# EAGLE schematic flux2_a1 (EAGLE 7.2.0)
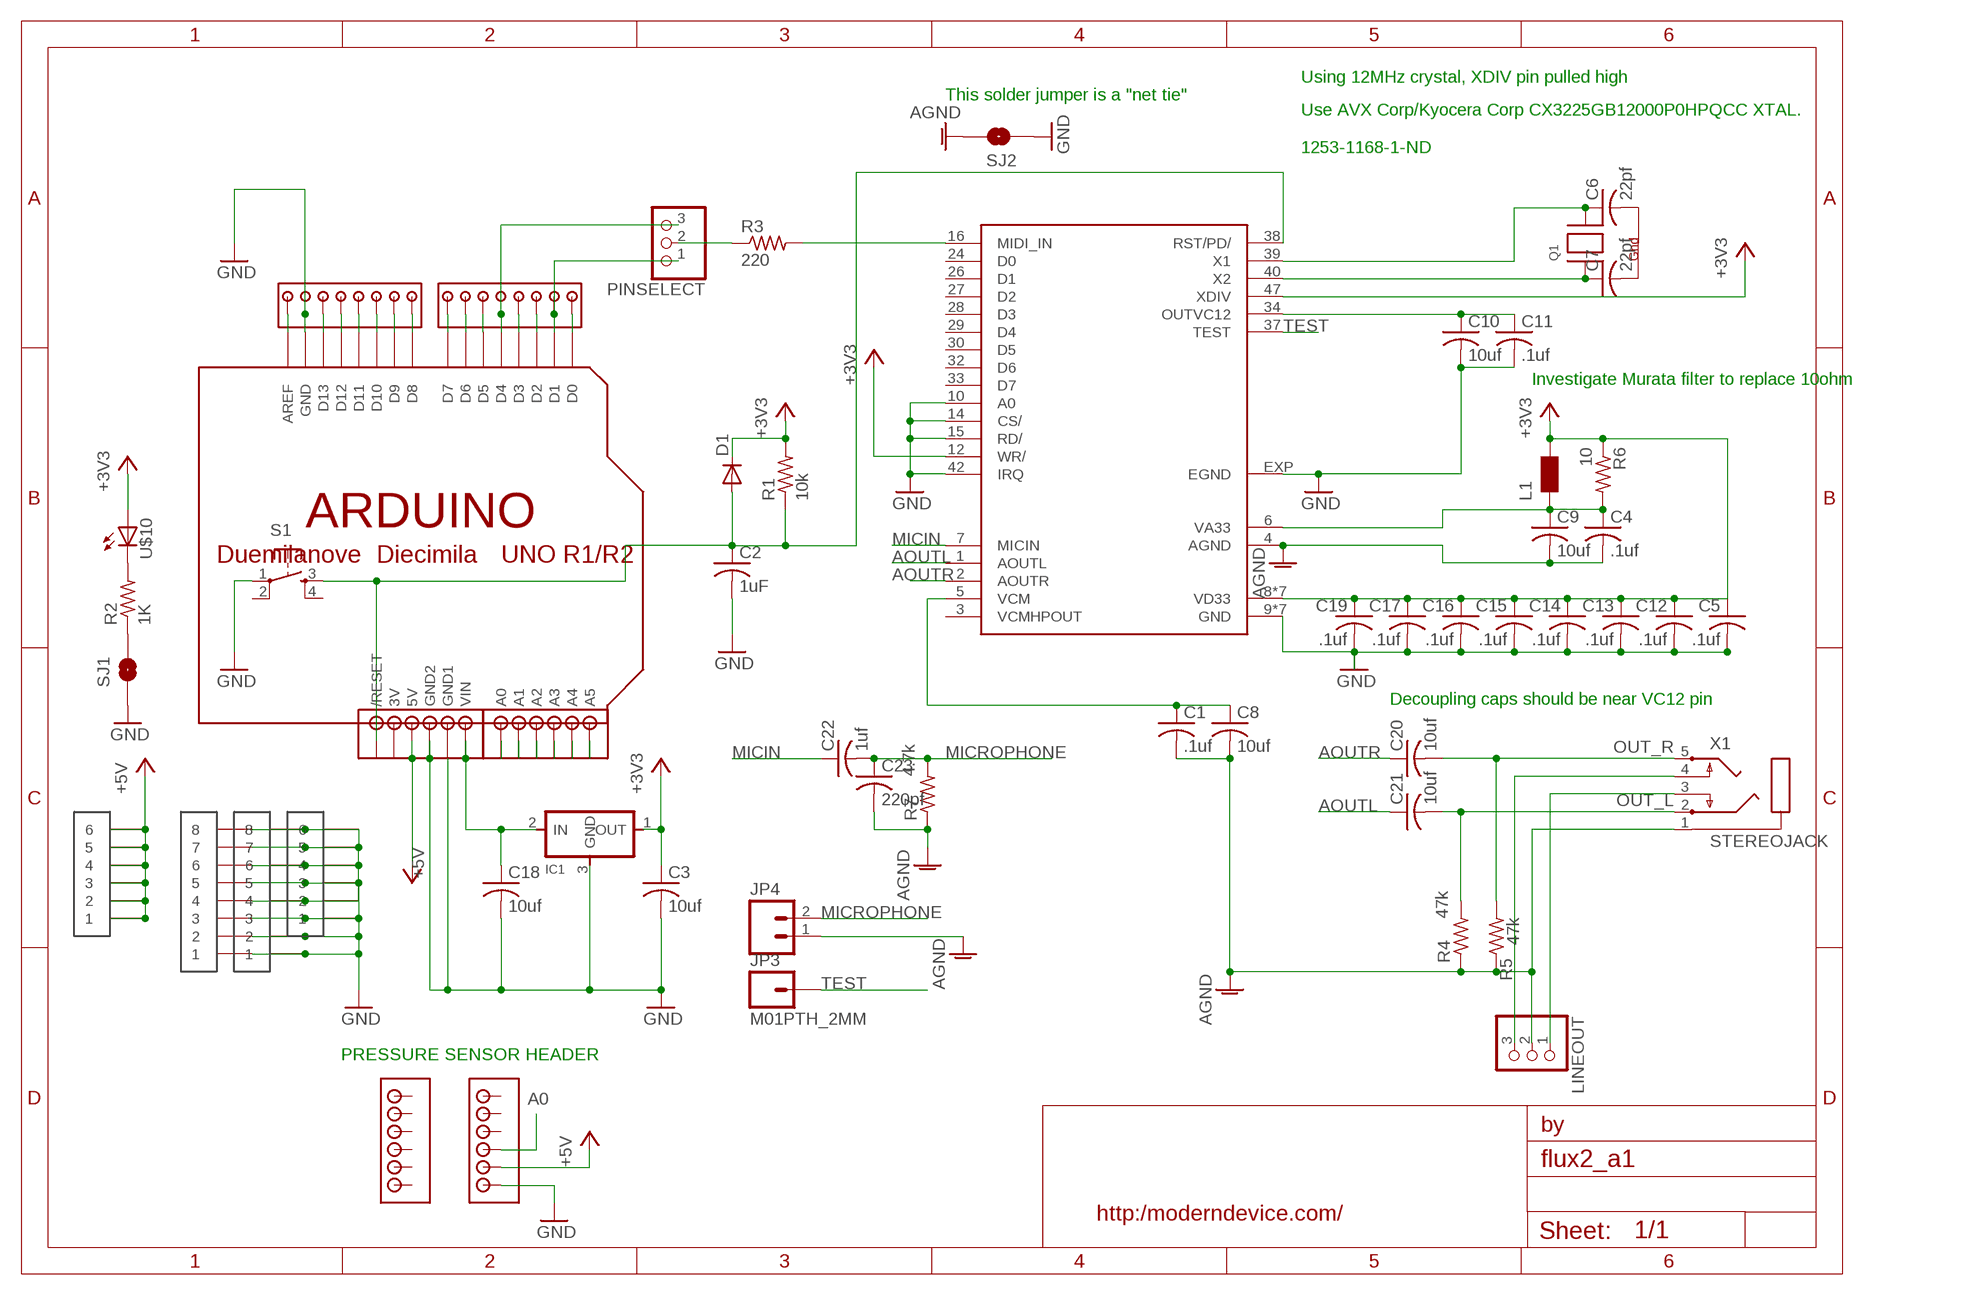
[diagram p0: schematic, sheet 1]

## Parts
C1  .1uf  C-USC0805  [C0805]
C2  1uF  C-USC0805  [C0805]
C3  10uf  C-USC0805  [C0805]
C4  .1uf  C-USC0805  [C0805]
C5  .1uf  C-USC0805  [C0805]
C6  22pf  C-USC0805  [C0805]
C7  22pf  C-USC0805  [C0805]
C8  10uf  C-USC0805  [C0805]
C9  10uf  C-USC0805  [C0805]
C10  10uf  C-USC0805  [C0805]
C11  .1uf  C-USC0805  [C0805]
C12  .1uf  C-USC0805  [C0805]
C13  .1uf  C-USC0805  [C0805]
C14  .1uf  C-USC0805  [C0805]
C15  .1uf  C-USC0805  [C0805]
C16  .1uf  C-USC0805  [C0805]
C17  .1uf  C-USC0805  [C0805]
C18  10uf  C-USC0805  [C0805]
C19  .1uf  C-USC0805  [C0805]
C20  10uf  C-USC0805  [C0805]
C21  10uf  C-USC0805  [C0805]
C22  1uf  C-USC0805  [C0805]
C23  220pf  C-USC0805  [C0805]
D1  DIODESOD123  [SOD123]
IC1  REGULATORSOT23  [SOT23]
JP3  M01PTH_2MM  [1X01_2MM]
JP4  M02PTH  [1X02]
L1  FERRITE_BEAD_L0603  [R0603]
LINEOUT  PINHD-1X3  [1X03]
PINSELECT  PINHD-1X3  [1X03]
Q1  MODERNDEVICE_XTAL-4-3225  [MODERNDEVICE_NX3225]
R1  10k  R-US_M0805  [M0805]
R2  1K  R-US_M0805  [M0805]
R3  220  R-US_M0805  [M0805]
R4  47k  R-US_M0805  [M0805]
R5  47k  R-US_M0805  [M0805]
R6  10  R-US_M0805  [M0805]
R7  4.7k  R-US_M0805  [M0805]
S1  6MM_SWITCH6MM_SWITCH  [6MM_SWITCH]
SJ1  MODERNDEVICE_SOLDERJUMPERTRACE  [MODERNDEVICE_SJ_2S-TRACE]
SJ2  MODERNDEVICE_SOLDERJUMPERTRACE  [MODERNDEVICE_SJ_2S-TRACE]
U1  SAM2695  [QFN48]
U$1  1X8_CLEAN  [1X8_CLEAN]
U$2  1X6_CLEAN  [1X6_CLEAN]
U$3  1X6_CLEAN  [1X6_CLEAN]
U$4  1X6HEADER  [1X6HEADER]
U$5  1X6HEADER  [1X6HEADER]
U$6  1X8HEADER  [1X8HEADER]
U$7  1X6HEADER  [1X6HEADER]
U$8  1X6HEADER  [1X6HEADER]
U$9  1X8HEADER  [1X8HEADER]
U$10  LED1206  [1206]
U$11  1X8_CLEAN  [1X8_CLEAN]
U$12  ARDUINO-NOHOLE  [ARDUINO-NOHOLE]
X1  STEREOJACK  [STX3100]

## Nets
+3V3 [VCC]: C3.1 D1.CATHODE(C) IC1.1(OUT) L1.2 R1.2 R6.1 U1.12(WR/) U1.47(XDIV) U$10.1(A)
+5V [VCC]: U$2.P$1 U$2.P$2 U$2.P$3 U$2.P$4 U$2.P$5 U$2.P$6 U$7.P$2 U$8.P$3 U$12.5V
A0: U$5.P$1 U$7.P$3 U$12.A0
AGND [GND]: C1.2 C4.2 C8.2 C9.2 C23.2 JP4.1 LINEOUT.2 R4.1 R5.1 R7.1 SJ2.2 U1.4(AGND) X1.1
AOUTL: C21.1 U1.1(AOUTL)
AOUTR: C20.1 U1.2(AOUTR)
GND [GND]: C2.2 C3.2 C5.2 C10.2 C11.2 C12.2 C13.2 C14.2 C15.2 C16.2 C17.2 C18.2 C19.2 IC1.3(GND) S1.1(P) SJ1.1 SJ2.1 U1.9(GND) U1.10(A0) U1.13(GND) U1.14(CS/) U1.15(RD/) U1.18(GND) U1.25(GND) U1.36(GND) U1.42(IRQ) U1.45(GND) U1.48(GND) U1.EXP(EGND) U$1.P$1 U$1.P$2 U$1.P$3 U$1.P$4 U$1.P$5 U$1.P$6 U$1.P$7 U$1.P$8 U$3.P$1 U$3.P$2 U$3.P$3 U$3.P$4 U$3.P$5 U$3.P$6 U$7.P$1 U$8.P$4 U$9.P$2 U$11.P$1 U$11.P$2 U$11.P$3 U$11.P$4 U$11.P$5 U$11.P$6 U$11.P$7 U$11.P$8 U$12.GND U$12.GND1 U$12.GND2
MICIN: C22.1 U1.7(MICIN)
MICROPHONE: C22.2 C23.1 JP4.2 R7.2
N$1: PINSELECT.2 R3.1
N$2: R3.2 U1.16(MIDI_IN)
N$3: C5.1 C12.1 C13.1 C14.1 C15.1 C16.1 C17.1 C19.1 U1.8(VD33) U1.11(VD33) U1.20(VD33) U1.31(VD33) U1.35(VD33) U1.41(VD33) U1.46(VD33)
N$5: C10.1 C11.1 U1.34(OUTVC12)
N$9: R2.2 U$10.2(C)
N$12: C1.1 C8.1 U1.5(VCM)
N$15: U$9.P$8 U$12.D8
N$17: PINSELECT.1 U$6.P$7 U$12.D1
N$18: PINSELECT.3 U$6.P$4 U$12.D4
N$19: U$9.P$7 U$12.D9
N$21: LINEOUT.3 X1.4
N$22: U$9.P$5 U$12.D11
N$23: U$9.P$6 U$12.D10
N$24: LINEOUT.1 X1.3
N$25: U$9.P$4 U$12.D12
N$26: U$9.P$3 U$12.D13
N$27: U$6.P$2 U$12.D6
N$28: U$9.P$1 U$12.AREF
N$29: U$6.P$3 U$12.D5
N$30: U$6.P$8 U$12.D0
N$31: U$6.P$6 U$12.D2
N$32: U$6.P$5 U$12.D3
N$35: U$6.P$1 U$12.D7
N$36: C2.1 D1.ANODE(A) R1.1 S1.3(S) U1.38(RST/PD/) U$8.P$1
N$39 [VCC]: C4.1 C9.1 L1.1 R6.2 U1.6(VA33)
N$41: U$5.P$2 U$12.A1
N$42: U$5.P$3 U$12.A2
N$43: U$5.P$4 U$12.A3
N$44: U$5.P$5 U$12.A4
N$45: U$5.P$6 U$12.A5
N$47: R2.1 SJ1.2
N$48: C6.1 Q1.3(X2) U1.39(X1)
N$49: C7.1 Q1.1(X1) U1.40(X2)
N$50: C6.2 Q1.2(G2)
N$51: C7.2 Q1.4(G1)
OUT_L: C21.2 R4.2 X1.2
OUT_R: C20.2 R5.2 X1.5
TEST: JP3.1 U1.37(TEST)
VIN [VCC]: C18.1 IC1.2(IN) U$8.P$6 U$12.VIN
Unconnected: S1.2(P1) S1.4(S1) U1.3(VCMHPOUT) U1.24(D0) U1.26(D1) U1.27(D2) U1.28(D3) U1.29(D4) U1.30(D5) U1.32(D6) U1.33(D7) U$4.P$1 U$4.P$2 U$4.P$3 U$4.P$4 U$4.P$5 U$4.P$6 U$7.P$4 U$7.P$5 U$7.P$6 U$8.P$2 U$8.P$5 U$12.RESET(/RESET)

## Notes on the sheet
- Using 12MHz crystal, XDIV pin pulled high
- This solder jumper is a "net tie"
- Use AVX Corp/Kyocera Corp CX3225GB12000P0HPQCC XTAL. 
  
  1253-1168-1-ND
- Investigate Murata filter to replace 10ohm
- Decoupling caps should be near VC12 pin
- PRESSURE SENSOR HEADER

## Power pins joined to a net without a drawn wire
3V: U$12.3V

## Library data of the parts
C1-C23 = rcl:C-US: CAPACITOR, American symbol
D1 = ng:DIODE: DIODE high speed (Philips)
IC1 = ng:REGULATOR
JP3 = ModernDevice:M01: Header 1 Standard 1-pin 0.1" header. Use with straight break away headers (SKU : PRT-00116), right angle break away headers (PRT-00553), swiss pins (PRT-00743), machine pins (PRT-00117), and female headers (PRT-00115).
JP4 = ModernDevice:M02: Header 2 Standard 2-pin 0.1" header. Use with straight break away headers (SKU : PRT-00116), right angle break away headers (PRT-00553), swiss pins (PRT-00743), machine pins (PRT-00117), and female headers (PRT-00115). Molex polarized connector foot print use with SKU : PRT-08233 with associated crimp pins and housings.
L1 = ModernDevice:FERRITE_BEAD: SMD EMI Suppression Ferrite Beads - excellent anti-EMI properties - low DCR - impedances till 3000 ohms - rated current up to 6 A These pads are small for some reason - L0603 has std resistor sized pads 240-2365-1-ND is a Digikey part with 300 ohms at 100Mhz
LINEOUT PINSELECT = pinhead:PINHD-1X3: PIN HEADER
Q1 = BBLeo_v2:MODERNDEVICE_XTAL-4: Classic 4-pin 3.2 x 2.5mm crystal
R1-R7 = rcl:R-US_: RESISTOR, American symbol
S1 = ng:6MM_SWITCH: OMRON SWITCH
SJ1 SJ2 = BBLeo_v2:MODERNDEVICE_SOLDERJUMPER: Solder Jumper Standard SMD solder jumper. Used to automate production. Two varients : Normally Open and Normally Closed are the same, but have different paste layers. NC will have a large amount of paste and should jumper during reflow.
U1 = ModernDevice:SAM2695
U$1 U$11 = ModernDevice:1X8_CLEAN
U$2 U$3 = ModernDevice:1X6_CLEAN
U$4 U$5 U$7 U$8 = ModernDeviceHeaders:1X6HEADER
U$6 U$9 = ModernDeviceHeaders:1X8HEADER
U$10 = ng:LED
U$12 = adafruit:ARDUINO: Arduino Diecimila/Duemilanove Make a shield with ease, this package has all the named pins as well as the two mounting drill holes and an outline of the USB and DC power connector. The outline is on the DIMENSION layer, so if your board house uses it they will cut the outline to match. http://www.ladyada.net/library/pcb/eaglelibrary.html
X1 = adafruit:STEREOJACK: MIC/HEADPHONE JACK Stereo jack with two switches. Kycon STX3100, CUI SJ1-3555NG and/or 4UCon 05544

## Net classes
1 GND: width 0.305 mm
2 VCC: width 0.305 mm
3 VBUS: width 0.508 mm